# Altium schematic sheet 006_HDMI.SchDoc: =title_line_1 + title_line_2
size 840 x 594 mm; SheetNumber: 6
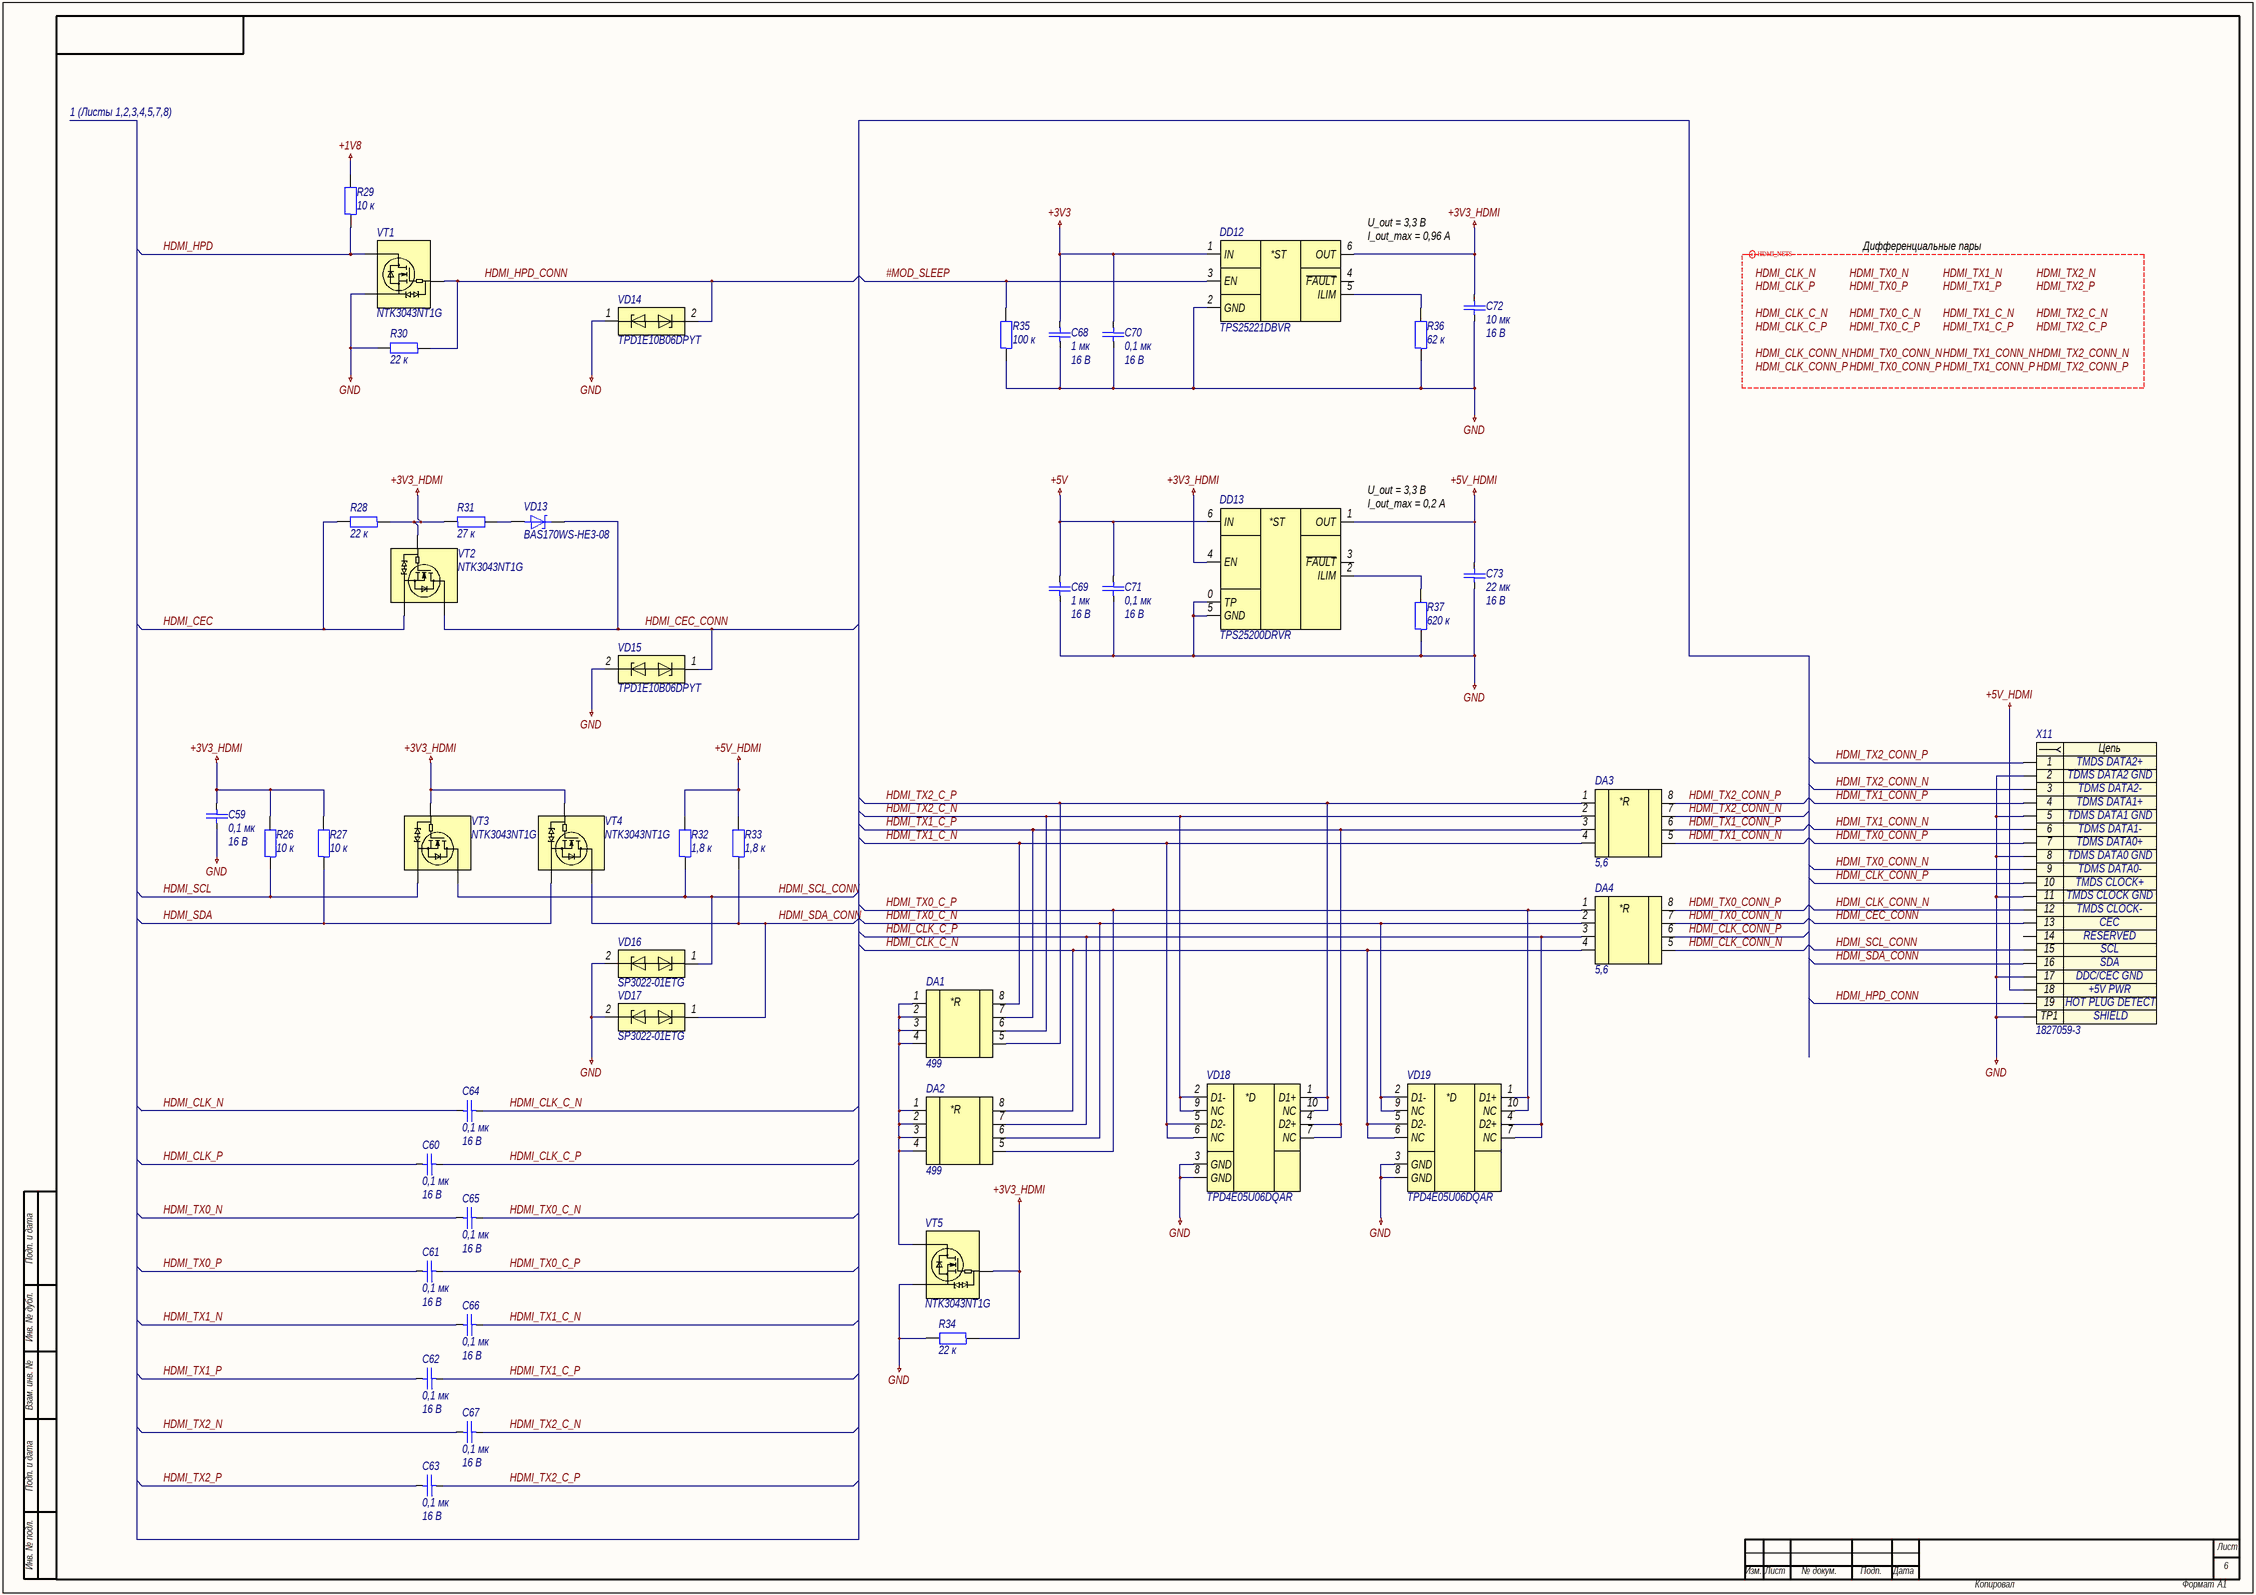
[diagram p0: 006_HDMI.SchDoc]

## Parts
C59  0,1 мк  Напряжение: 16 В  [C0603]
C60  0,1 мк  Напряжение: 16 В  [C0603]
C61  0,1 мк  Напряжение: 16 В  [C0603]
C62  0,1 мк  Напряжение: 16 В  [C0603]
C63  0,1 мк  Напряжение: 16 В  [C0603]
C64  0,1 мк  Напряжение: 16 В  [C0603]
C65  0,1 мк  Напряжение: 16 В  [C0603]
C66  0,1 мк  Напряжение: 16 В  [C0603]
C67  0,1 мк  Напряжение: 16 В  [C0603]
C68  1 мк  Напряжение: 16 В  [C0603]
C69  1 мк  Напряжение: 16 В  [C0603]
C70  0,1 мк  Напряжение: 16 В  [C0603]
C71  0,1 мк  Напряжение: 16 В  [C0603]
C72  10 мк  Напряжение: 16 В  [C0603]
C73  22 мк  Напряжение: 16 В  [C0805]
DA1  499  [R0603-X4]
DA2  499  [R0603-X4]
DA3  5,6  [R0603-X4]
DA4  5,6  [R0603-X4]
DD12  TPS25221DBVR  [SOT-23-6-P95-290X280X145]
DD13  TPS25200DRVR  [WSON-6-P65-200X200X80-L30X25-T170X110]
R26  10 к  [R0603]
R27  10 к  [R0603]
R28  22 к  [R0603]
R29  10 к  [R0603]
R30  22 к  [R0603]
R31  27 к  [R0603]
R32  1,8 к  [R0603]
R33  1,8 к  [R0603]
R34  22 к  [R0603]
R35  100 к  [R0603]
R36  62 к  [R0603]
R37  620 к  [R0603]
VD13  BAS170WS-HE3-08  [SOD-123-268X130X115]
VD14  TPD1E10B06DPYT  [X1SON-2-100X60X45]
VD15  TPD1E10B06DPYT  [X1SON-2-100X60X45]
VD16  SP3022-01ETG  [SOD-882-100X60X60]
VD17  SP3022-01ETG  [SOD-882-100X60X60]
VD18  TPD4E05U06DQAR  [USON-10-P50-250X100X55-L36X20]
VD19  TPD4E05U06DQAR  [USON-10-P50-250X100X55-L36X20]
VT1  NTK3043NT1G  [SOT-723-3-P40-120X120X55]
VT2  NTK3043NT1G  [SOT-723-3-P40-120X120X55]
VT3  NTK3043NT1G  [SOT-723-3-P40-120X120X55]
VT4  NTK3043NT1G  [SOT-723-3-P40-120X120X55]
VT5  NTK3043NT1G  [SOT-723-3-P40-120X120X55]
X11  1827059-3  [1827059-3]

## Nets
+1V8: R29.2
+3V3: C68.1 C70.2 DD12.1(IN)
+3V3_HDMI: C59.2 C72.1 DD12.6(OUT) DD13.4(EN) R26.2 R27.2 R28.1 R31.1 R34.1 VT2.G VT3.G VT4.G VT5.G
+5V: C69.1 C71.2 DD13.6(IN)
+5V_HDMI: C73.1 DD13.1(OUT) R32.2 R33.2 X11.18
GND: C59.1 C68.2 C69.2 C70.1 C71.1 C72.2 C73.2 DD12.2(GND) DD13.0(TP) DD13.5(GND) R30.2 R34.2 R35.1 R36.1 R37.1 VD14.1 VD15.2 VD16.2 VD17.2 VD18.3(GND) VD18.8(GND) VD19.3(GND) VD19.8(GND) VT1.S VT5.S X11.2 X11.5 X11.8 X11.11 X11.17 X11.TP1
#MOD_SLEEP: DD12.3(EN) R35.2
HDMI_CEC: R28.2 VT2.S
HDMI_CEC_CONN: VD13.1 VD15.1 VT2.D X11.13
HDMI_CLK_C_N: C64.2 DA2.8 DA4.4 VD19.5(D2-) VD19.6(NC)
HDMI_CLK_C_P: C60.2 DA2.7 DA4.3 VD19.4(D2+) VD19.7(NC)
HDMI_CLK_CONN_N: DA4.5 X11.12
HDMI_CLK_CONN_P: DA4.6 X11.10
HDMI_CLK_N: C64.1
HDMI_CLK_P: C60.1
HDMI_HPD: R29.1 VT1.D
HDMI_HPD_CONN: R30.1 VD14.2 VT1.G X11.19
HDMI_SCL: R26.1 VT3.S
HDMI_SCL_CONN: R32.1 VD16.1 VT3.D X11.15
HDMI_SDA: R27.1 VT4.S
HDMI_SDA_CONN: R33.1 VD17.1 VT4.D X11.16
HDMI_TX0_C_N: C65.2 DA2.6 DA4.2 VD19.2(D1-) VD19.9(NC)
HDMI_TX0_C_P: C61.2 DA2.5 DA4.1 VD19.1(D1+) VD19.10(NC)
HDMI_TX0_CONN_N: DA4.7 X11.9
HDMI_TX0_CONN_P: DA4.8 X11.7
HDMI_TX0_N: C65.1
HDMI_TX0_P: C61.1
HDMI_TX1_C_N: C66.2 DA1.8 DA3.4 VD18.5(D2-) VD18.6(NC)
HDMI_TX1_C_P: C62.2 DA1.7 DA3.3 VD18.4(D2+) VD18.7(NC)
HDMI_TX1_CONN_N: DA3.5 X11.6
HDMI_TX1_CONN_P: DA3.6 X11.4
HDMI_TX1_N: C66.1
HDMI_TX1_P: C62.1
HDMI_TX2_C_N: C67.2 DA1.6 DA3.2 VD18.2(D1-) VD18.9(NC)
HDMI_TX2_C_P: C63.2 DA1.5 DA3.1 VD18.1(D1+) VD18.10(NC)
HDMI_TX2_CONN_N: DA3.7 X11.3
HDMI_TX2_CONN_P: DA3.8 X11.1
HDMI_TX2_N: C67.1
HDMI_TX2_P: C63.1
NetDA1_1: DA1.1 DA1.2 DA1.3 DA1.4 DA2.1 DA2.2 DA2.3 DA2.4 VT5.D
NetDD12_5: DD12.5(ILIM) R36.2
NetDD13_2: DD13.2(ILIM) R37.2
NetR31_2: R31.2 VD13.2

Not connected (* = marked no-connect by the designer): DD12 4(~{FAULT}); DD13 3(~{FAULT}); X11 14

## Layout directives
differential pair; rule Differential Pairs Routing [Pref Gap = 0.3mm    Min Gap  = 0.15mm    Max Gap  = 0.3mmPref Width = 0.126mm    Min Width  = 0.126mm    Max Width  = 0.155mm]; differential pair class HDMI_SIGNALS: HDMI_CLK_C_N, HDMI_CLK_C_P, HDMI_CLK_CONN_N, HDMI_CLK_CONN_P, HDMI_CLK_N, HDMI_CLK_P, HDMI_TX0_C_N, HDMI_TX0_C_P, HDMI_TX0_CONN_N, HDMI_TX0_CONN_P, HDMI_TX0_N, HDMI_TX0_P, HDMI_TX1_C_N, HDMI_TX1_C_P, HDMI_TX1_CONN_N, HDMI_TX1_CONN_P, HDMI_TX1_N, HDMI_TX1_P, HDMI_TX2_C_N, HDMI_TX2_C_P, HDMI_TX2_CONN_N, HDMI_TX2_CONN_P, HDMI_TX2_N, HDMI_TX2_P

## Notes on the sheet
- 1 (Листы 1,2,3,4,5,7,8)
- U_out = 3,3 В
  I_out_max = 0,96 А
- Дифференциальные пары
- U_out = 3,3 В
  I_out_max = 0,2 А
- Labels drawn without touching a wire or pin: HDMI_CLK_C_N, HDMI_CLK_C_P, HDMI_CLK_CONN_N, HDMI_CLK_CONN_P, HDMI_CLK_N, HDMI_CLK_P, HDMI_TX0_C_N, HDMI_TX0_C_P, HDMI_TX0_CONN_N, HDMI_TX0_CONN_P, HDMI_TX0_N, HDMI_TX0_P, HDMI_TX1_C_N, HDMI_TX1_C_P, HDMI_TX1_CONN_N, HDMI_TX1_CONN_P, HDMI_TX1_N, HDMI_TX1_P, HDMI_TX2_C_N, HDMI_TX2_C_P, HDMI_TX2_CONN_N, HDMI_TX2_CONN_P, HDMI_TX2_N, HDMI_TX2_P
- Подп. и дата
- Инв. № дубл.
- Взам. инв. №
- Инв. № подл.
- Лист
- Изм.
- № докум.
- Подп.
- Дата
- Копировал
- Формат
- А1
- (in symbol da0004) *R
- (in symbol da0026) *R
- (in symbol dd0001) *ST
- (in symbol dd0002) *ST
- (in symbol vd0017) *D
- (in symbol x0012) Цепь

## Library data of the parts
C59-C67 C70 C71 = c0081: =Описание; ID: c0081; Фамилия: Паньков; Описание: Конденсатор керамический чип 0603 100 нФ 16 В ±10 %; Наименование: CC0603KRX7R7BB104; Производитель: YAGEO Corp.; Отклонение: ±10 %; Рабочие температуры: от –55 °С до +125 °С; Температурный коэффициент емкости: X7R; Корпус: 0603; Номинал: 0,1 мк; Номинальное напряжение: 16 В; HelpURL: https://www.yageo.com/upload/media/product/productsearch/datasheet/mlcc/UPY-GPHC_X7R_6.3V-to-50V_20.pdf
C68 C69 = c0113: =Описание; ID: c0113; Фамилия: Паньков; Описание: Конденсатор керамический чип 0603 1 мкФ 16 В ±10 %; Наименование: CC0603KRX7R7BB105; Производитель: YAGEO Corp.; Отклонение: ±10 %; Рабочие температуры: от –55 °С до +125 °С; Температурный коэффициент емкости: X7R; Корпус: 0603; Номинал: 1 мк; Номинальное напряжение: 16 В; HelpURL: https://www.yageo.com/upload/media/product/productsearch/datasheet/mlcc/UPY-GPHC_X7R_6.3V-to-50V_20.pdf
C72 = c0145: =Описание; ID: c0145; Фамилия: Паньков; Описание: Конденсатор керамический чип 0603 10 мкФ 16 В ±10 %; Наименование: CC0603KRX5R7BB106; Производитель: YAGEO Corp.; Отклонение: ±10 %; Рабочие температуры: от –55 °С до +85 °С; Температурный коэффициент емкости: X5R; Корпус: 0603; Номинал: 10 мк; Номинальное напряжение: 16 В; HelpURL: https://www.yageo.com/upload/media/product/productsearch/datasheet/mlcc/UPY-GPHC_X5R_4V-to-50V_26.pdf
C73 = c0159: =Описание; ID: c0159; Фамилия: Паньков; Описание: Конденсатор керамический чип 0805 22 мкФ 16 В ±20 %; Наименование: CC0805MRX5R7BB226; Производитель: YAGEO Corp.; Отклонение: ±20 %; Рабочие температуры: от –55 °С до +85 °С; Температурный коэффициент емкости: X5R; Корпус: 0805; Номинал: 22 мк; Номинальное напряжение: 16 В; HelpURL: https://www.yageo.com/upload/media/product/productsearch/datasheet/mlcc/UPY-GPHC_X5R_4V-to-50V_26.pdf
DA1 DA2 = da0026: =Описание; ID: da0026; Фамилия: Ларионов; Описание: Резисторная сборка чип 0603 x4 499 Ом ±1 % 0,1 Вт; Наименование: TC164-FR-07499RL; Производитель: YAGEO Corp.; Отклонение: ±1 %; Номинальное напряжение: 50 В; Номинальный ток: 1 А; Рабочие температуры: от –55 °С до +155 °С; Корпус: 0603 x4; Номинал: 499; HelpURL: https://www.yageo.com/upload/media/product/productsearch/datasheet/rchip/PYu-YC_TC_group_51_RoHS_L_9.pdf
DA3 DA4 = da0004: =Описание; ID: da0004; Фамилия: Ларионов; Описание: Резисторная сборка чип 0603 x4 5,6 Ом ±5 % 0,1 Вт; Наименование: TC164-JR-075R6L; Производитель: YAGEO Corp.; Отклонение: ±5 %; Номинальное напряжение: 50 В; Номинальный ток: 1 А; Рабочие температуры: от –55 °С до +155 °С; Корпус: 0603 x4; Номинал: 5,6; HelpURL: https://www.yageo.com/upload/media/product/productsearch/datasheet/rchip/PYu-YC_TC_group_51_RoHS_L_9.pdf
DD12 = dd0001: =Описание; ID: dd0001; Фамилия: Ларионов; Описание: Силовой ключ 5,5 В и 2,5 А; Производитель: Texas Instruments Inc.; Напряжение: от 2,5 В до 5,5 В; Максимальное напряжение: 5,5 В; Ток: от 0,25 А до 2,7 А; Рабочие температуры: от –40 °С до +125 °С; Корпус: SOT-23-6; Наименование: TPS25221DBVR; HelpURL: https://www.ti.com/product/TPS25221
DD13 = dd0002: =Описание; ID: dd0002; Фамилия: Ларионов; Описание: Защитная микросхема eFuse 6,5 В и 2,9 А; Производитель: Texas Instruments Inc.; Напряжение: от 2,5 В до 6,5 В; Максимальное напряжение: 20 В; Ток: от 0,085 А до 2,9 А; Рабочие температуры: от –40 °С до +125 °С; Корпус: WSON-6; Наименование: TPS25200DRVR; HelpURL: https://www.ti.com/product/TPS25200
R26 R27 R29 = r0105: =Описание; ID: r0105; Фамилия: Самарин; Описание: Резистор чип 0603 10 кОм ±1 % 0,1 Вт; Наименование: RC0603FR-0710KL; Производитель: YAGEO Corp.; Отклонение: ±1 %; Номинальное напряжение: 75 В; Номинальный ток: 1 А; Рабочие температуры: от –55 °С до +155 °С; Корпус: 0603; Примечание: Ряд E24; Номинал: 10 к; HelpURL: https://www.yageo.com/upload/media/product/productsearch/datasheet/rchip/PYu-RC_Group_51_RoHS_L_11.pdf
R28 R30 R34 = r0117: =Описание; ID: r0117; Фамилия: Паньков; Описание: Резистор чип 0603 22 кОм ±1 % 0,1 Вт; Наименование: RC0603FR-0722KL; Производитель: YAGEO Corp.; Отклонение: ±1 %; Номинальное напряжение: 75 В; Номинальный ток: 1 А; Рабочие температуры: от –55 °С до +155 °С; Корпус: 0603; Примечание: Ряд E24; Номинал: 22 к; HelpURL: https://www.yageo.com/upload/media/product/productsearch/datasheet/rchip/PYu-RC_Group_51_RoHS_L_11.pdf
R31 = r0120: =Описание; ID: r0120; Фамилия: Паньков; Описание: Резистор чип 0603 27 кОм ±1 % 0,1 Вт; Наименование: RC0603FR-0727KL; Производитель: YAGEO Corp.; Отклонение: ±1 %; Номинальное напряжение: 75 В; Номинальный ток: 1 А; Рабочие температуры: от –55 °С до +155 °С; Корпус: 0603; Примечание: Ряд E24; Номинал: 27 к; HelpURL: https://www.yageo.com/upload/media/product/productsearch/datasheet/rchip/PYu-RC_Group_51_RoHS_L_11.pdf
R32 R33 = r0083: =Описание; ID: r0083; Фамилия: Паньков; Описание: Резистор чип 0603 1,8 кОм ±1 % 0,1 Вт; Наименование: RC0603FR-071K8L; Производитель: YAGEO Corp.; Отклонение: ±1 %; Номинальное напряжение: 75 В; Номинальный ток: 1 А; Рабочие температуры: от –55 °С до +155 °С; Корпус: 0603; Примечание: Ряд E24; Номинал: 1,8 к; HelpURL: https://www.yageo.com/upload/media/product/productsearch/datasheet/rchip/PYu-RC_Group_51_RoHS_L_11.pdf
R35 = r0141: =Описание; ID: r0141; Фамилия: Водорезов; Описание: Резистор чип 0603 100 кОм ±1 % 0,1 Вт; Наименование: RC0603FR-07100KL; Производитель: YAGEO Corp.; Отклонение: ±1 %; Номинальное напряжение: 75 В; Номинальный ток: 1 А; Рабочие температуры: от –55 °С до +155 °С; Корпус: 0603; Примечание: Ряд E24; Номинал: 100 к; HelpURL: https://www.yageo.com/upload/media/product/productsearch/datasheet/rchip/PYu-RC_Group_51_RoHS_L_11.pdf
R36 = r0135: =Описание; ID: r0135; Фамилия: Паньков; Описание: Резистор чип 0603 62 кОм ±1 % 0,1 Вт; Наименование: RC0603FR-0762KL; Производитель: YAGEO Corp.; Отклонение: ±1 %; Номинальное напряжение: 75 В; Номинальный ток: 1 А; Рабочие температуры: от –55 °С до +155 °С; Корпус: 0603; Примечание: Ряд E24; Номинал: 62 к; HelpURL: https://www.yageo.com/upload/media/product/productsearch/datasheet/rchip/PYu-RC_Group_51_RoHS_L_11.pdf
R37 = r0168: =Описание; ID: r0168; Фамилия: Паньков; Описание: Резистор чип 0603 620 кОм ±1 % 0,1 Вт; Наименование: RC0603FR-07620KL; Производитель: YAGEO Corp.; Отклонение: ±1 %; Номинальное напряжение: 75 В; Номинальный ток: 1 А; Рабочие температуры: от –55 °С до +155 °С; Корпус: 0603; Примечание: Ряд E24; Номинал: 620 к; HelpURL: https://www.yageo.com/upload/media/product/productsearch/datasheet/rchip/PYu-RC_Group_51_RoHS_L_11.pdf
VD13 = vd0006: =Описание; ID: vd0006; Фамилия: Ларионов; Описание: Диод Шоттки 70 В 0,07 А; Производитель: Vishay Intertechnology, Inc.; Максимальное прямое напряжение: 0,75 В; Максимальное обратное напряжение: 70 В; Максимальный прямой ток: 0,07 А; Рабочие температуры: от –55 °С до +125 °С; Корпус: SOD-123; Наименование: BAS170WS-HE3-08; HelpURL: https://www.vishay.com/diodes/list/product-85653/
VD14 VD15 = vd0013: =Описание; ID: vd0013; Фамилия: Ларионов; Описание: Двунаправленная диодная сборка для подавления помех 5,5 В; Производитель: Texas Instruments Inc.; Корпус: X1SON-2; Наименование: TPD1E10B06DPYT; HelpURL: https://www.ti.com/product/TPD1E10B06
VD16 VD17 = vd0003: =Описание; ID: vd0003; Фамилия: Ларионов; Описание: Двунаправленная диодная сборка для подавления помех 5 В; Производитель: Littelfuse, Inc.; Корпус: SOD-882; Наименование: SP3022-01ETG; HelpURL: https://www.littelfuse.com/products/tvs-diode-arrays/low-capacitance-esd-protection/sp3022.aspx#
VD18 VD19 = vd0017: =Описание; ID: vd0017; Фамилия: Ларионов; Описание: Диодная сборка для подавления помех 5,5 В; Производитель: Texas Instruments Inc.; Корпус: USON-10; Наименование: TPD4E05U06DQAR; HelpURL: https://www.ti.com/product/TPD4E05U06
VT1-VT5 = vt0001: =Описание; ID: vt0001; Фамилия: Ларионов; Описание: Полевой N-канальный МДП-транзистор 20 В 0,255 А; Производитель: ON Semiconductor; Напряжение затвор — исток: ±10 В; Напряжение сток — исток: 20 В; Ток стока: 0,255 А; Сопротивление сток — исток: 15 Ом; Рабочие температуры: от –55 °С до +150 °С; Корпус: SOT-723; Наименование: NTK3043NT1G; HelpURL: https://www.onsemi.com/products/discretes-drivers/mosfets/ntk3043n
X11 = x0012: =Описание; Contact_1: TMDS DATA2+; Contact_2: TDMS DATA2 GND; Contact_3: TDMS DATA2-; Contact_4: TDMS DATA1+; Contact_5: TDMS DATA1 GND; Contact_6: TDMS DATA1-; Contact_7: TDMS DATA0+; Contact_8: TDMS DATA0 GND; Contact_9: TDMS DATA0-; Contact_10: TMDS CLOCK+; Contact_11: TMDS CLOCK GND; Contact_12: TMDS CLOCK-; Contact_13: CEC; Contact_14: RESERVED; Contact_15: SCL; Contact_16: SDA; Contact_17: DDC/CEC GND; Contact_18: +5V PWR; Contact_19: HOT PLUG DETECT; TP1: SHIELD; ID: x0012; Фамилия: Паньков; Описание: HDMI Type A гнездо угловой; Производитель: TE Connectivity; Наименование: 1827059-3; HelpURL: https://www.te.com/usa-en/product-1827059-3.html